# Altium schematic sheet QR_Scanning2_V1_STM32.SchDoc: QR_Scanning_V1_STM32
size 381 x 241 mm; ApprovedBy: VARUN; CheckedBy: VARUN; Author: non; CompanyName: Houston Systom Pvt. Ltd.; DrawnBy: VARUN; Engineer: VARUN; Address1: Greator Noida; SheetNumber: 3; SheetTotal: 3
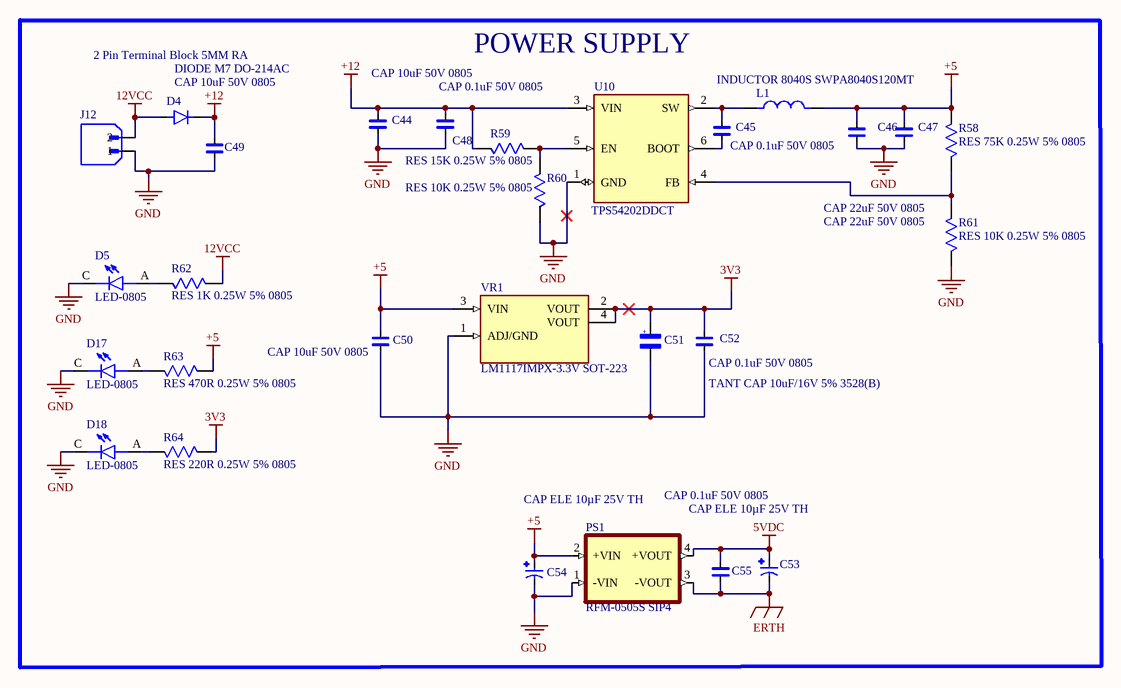
[diagram p0: QR_Scanning2_V1_STM32.SchDoc]

## Parts
C44  CAP 10uF 50V 0805  [CAP CER 0.1uF/50V 5%]
C45  CAP 0.1uF 50V 0805  [CAP CER 0.1uF/50V 5%]
C46  CAP 22uF 50V 0805  [CAP CER 0.1uF/50V 5%]
C47  CAP 22uF 50V 0805  [CAP CER 0.1uF/50V 5%]
C48  CAP 0.1uF 50V 0805  [CAP CER 0.1uF/50V 5%]
C49  CAP 10uF 50V 0805  [CAP CER 0.1uF/50V 5%]
C50  CAP 10uF 50V 0805  [CAP CER 0.1uF/50V 5%]
C51  TANT CAP 10uF/16V 5% 3528(B)  [TANT CAP 3528(B)]
C52  CAP 0.1uF 50V 0805  [CAP CER 0.1uF/50V 5%]
C53  CAP ELE 10µF 25V TH  [CAP ELE 10µF 25V TH]
C54  CAP ELE 10µF 25V TH  [CAP ELE 10µF 25V TH]
C55  CAP 0.1uF 50V 0805  [CAP CER 0.1uF/50V 5%]
D4  DIODE M7 DO-214AC  [DIODE M7 DO-214AC]
D5  LED-0805  [LED-0805]
D17  LED-0805  [LED-0805]
D18  LED-0805  [LED-0805]
J12  2 Pin Terminal Block 5MM RA  [2 Pin Terminal Block 5MM RA]
L1  INDUCTOR 8040S SWPA8040S120MT  [INDUCTOR 8040S SWPA8040S120MT]
PS1  RFM-0505S SIP4  [RFM-0505S]
R58  RES 75K 0.25W 5% 0805  [RES 0805 10K/0.25W 5%]
R59  RES 15K 0.25W 5% 0805  [RES 0805 10K/0.25W 5%]
R60  RES 10K 0.25W 5% 0805  [RES 0805 10K/0.25W 5%]
R61  RES 10K 0.25W 5% 0805  [RES 0805 10K/0.25W 5%]
R62  RES 1K 0.25W 5% 0805  [RES 0805 10K/0.25W 5%]
R63  RES 470R 0.25W 5% 0805  [RES 0805 10K/0.25W 5%]
R64  RES 220R 0.25W 5% 0805  [RES 0805 10K/0.25W 5%]
U10  TPS54202DDCT  [TPS54202DDCT]
VR1  LM1117IMPX-3.3V SOT-223  [LM1117IMPX-3.3V SOT-223]

## Blocks framed on the sheet
POWER SUPPLY: C44-C55 D4 D5 D17 D18 J12 L1 PS1 R58-R64 U10 VR1

## Nets
3V3: C51.1 C52.2 R64.2 VR1.2(VOUT) VR1.4(VOUT)
5VDC: C53.P C55.2 PS1.4(+VOUT)
12VCC: D4.A J12.2 R62.2
+5: C46.2 C47.2 C50.2 C54.P L1.2 PS1.2(+VIN) R58.2 R63.2 VR1.3(VIN)
+12: C44.2 C48.2 C49.2 D4.C(K) R59.1 U10.3(VIN)
ERTH: C53.N C55.1 PS1.3(-VOUT)
GND: C44.1 C46.1 C47.1 C48.1 C49.1 C50.1 C51.2 C52.1 C54.N D5.C D17.C D18.C J12.1 PS1.1(-VIN) R60.1 R61.1 U10.1(GND) VR1.1(ADJ/GND)
NetC45_1: C45.1 U10.6(BOOT)
NetC45_2: C45.2 L1.1 U10.2(SW)
NetD5_A: D5.A R62.1
NetD17_A: D17.A R63.1
NetD18_A: D18.A R64.1
NetR58_1: R58.1 R61.2 U10.4(FB)
NetR59_2: R59.2 R60.2 U10.5(EN)

## Notes on the sheet
- (in symbol TANT CAP 10uF/16V 5% 3528(B)) +

## Library data of the parts
C44-C50 C52 = CAP CER 0.1uF/50V 5%: CAP CER 0.1uF/50V  Ceramic Capacitor X7R 0805 (2012 Metric) SMT; MF: Samsung; MP: CL21B104KCFNNNE; Purchase-URL: https://pricing.snapeda.com/search?q=CL21B104KCFNNNE&ref=eda; Package: 0805 Samsung; Check_prices: https://www.snapeda.com/parts/CL21B104KCFNNNE/Samsung+Electro-Mechanics/view-part/?ref=eda; Value: *; SnapEDA_Link: https://www.snapeda.com/parts/CL21B104KCFNNNE/Samsung+Electro-Mechanics/view-part/?ref=snap; Digi-Key_Part_Number: 1276-6840-2-ND
C51 = TANT CAP 10uF/16V 5% 3528(B): 10 ÂµF Molded Tantalum Polymer Capacitor 25 V 1411 (3528 Metric), 1210 150mOhm TCJB106M025R0150; MF: AVX; SnapEDA_Link: https://www.snapeda.com/parts/TCJB106M025R0150/AVX/view-part/?ref=snap; Package: 1210 AVX; Value: *; MP: TCJB106M025R0150; Check_prices: https://www.snapeda.com/parts/TCJB106M025R0150/AVX/view-part/?ref=eda
C53 C54 = CAP ELE 10µF 25V TH: 10µF 25V Aluminum Electrolytic Capacitors Radial Lead Type TH, Dia-5mm, Pitch-2mm ECEA1EN100UI; MF: Panasonic; Package: RADIAL-2 Panasonic; Purchase-URL: https://pricing.snapeda.com/search/part/ECEA1EN100UI/?ref=eda; Value: *; Digi-Key_Part_Number: ECE-A1EN100UI-ND; SnapEDA_Link: https://www.snapeda.com/parts/ECEA1EN100UI/Panasonic/view-part/5788532/?ref=snap; MP: ECEA1EN100UI; Check_prices: https://www.snapeda.com/parts/ECEA1EN100UI/Panasonic/view-part/5788532/?ref=eda
C55 = CAP CER 0.1uF/50V 5%: CAP CER 0.1uF/50V  Ceramic Capacitor X7R 0805 (2012 Metric); MF: Samsung; MP: CL21B104KCFNNNE; Purchase-URL: https://pricing.snapeda.com/search?q=CL21B104KCFNNNE&ref=eda; Package: 0805 Samsung; Check_prices: https://www.snapeda.com/parts/CL21B104KCFNNNE/Samsung+Electro-Mechanics/view-part/?ref=eda; Value: *; SnapEDA_Link: https://www.snapeda.com/parts/CL21B104KCFNNNE/Samsung+Electro-Mechanics/view-part/?ref=snap; Digi-Key_Part_Number: 1276-6840-2-ND
D4 = DIODE M7 DO-214AC: M7 General Purpose SMD Rectifier Diode SMA (DO-214AC) 1A 1000V 1n4007 RS2MA; MF: Taiwan Semiconductor; SnapEDA_Link: https://www.snapeda.com/parts/RS2MA/Taiwan+Semiconductor/view-part/?ref=snap; Package: DO-214AC-2 Taiwan Semiconductor; Value: *; MP: RS2MA; Check_prices: https://www.snapeda.com/parts/RS2MA/Taiwan+Semiconductor/view-part/?ref=eda
D5 D17 D18 = LED-0805: Red 640nm LED Indication - Discrete 1.85V 0805 (2012 Metric) APT2012SRCPRV; MF: Kingbright; SnapEDA_Link: https://www.snapeda.com/parts/APT2012SRCPRV/Kingbright/view-part/?ref=snap; Package: 0805 Kingbright; Value: *; MP: APT2012SRCPRV; Check_prices: https://www.snapeda.com/parts/APT2012SRCPRV/Kingbright/view-part/?ref=eda
J12 = 2 Pin Terminal Block 5MM RA: 2 Pin Terminal Block HDR 5MM THT RA _OQ0271510000G; MF: Amphenol Anytek; SnapEDA_Link: https://www.snapeda.com/parts/OQ0271510000G/Amphenol/view-part/?ref=snap; Package: None; Value: *; MP: OQ0271510000G; Check_prices: https://www.snapeda.com/parts/OQ0271510000G/Amphenol/view-part/?ref=eda
L1 = INDUCTOR 8040S SWPA8040S120MT: SWPA8040S120MT SMD 8.0×8.0x4.0mm 8040S 12uH Â±20% 2.8A 142 mOhm SMT Shielded Wirewound Inductor; MF: Abracon LLC; MP: ASPI-8040S-510M-T; Purchase-URL: https://pricing.snapeda.com/search/part/ASPI-8040S-510M-T/?ref=eda; Value: *; SnapEDA_Link: https://www.snapeda.com/parts/ASPI-8040S-510M-T/Abracon+LLC/view-part/?ref=snap; Package: Nonstandard Abracon LLC; Check_prices: https://www.snapeda.com/parts/ASPI-8040S-510M-T/Abracon+LLC/view-part/?ref=eda; Availability: In Stock; Price: None
PS1 = RFM-0505S: DC-DC Converter/Isolator, SIP4, 1kV unreg, Single Output, 1W, 5V Out, RFM Series | RECOM Power Inc. RFM-0505S; SnapEDA_Link: https://www.snapeda.com/parts/RFM-0505S/Recom+Power/view-part/?ref=snap; Package: SIP-4 Recom Power; Value: *; MF: Recom Power; MP: RFM-0505S; Check_prices: https://www.snapeda.com/parts/RFM-0505S/Recom+Power/view-part/?ref=eda
R58-R64 = RES 10K 0.25W 5% 0805: RESISTOR, THICK FILM, 10K, 5%, 0805 0.25W SMT; MP: ERJ-6GEYJ103V; MF: Panasonic Electronic; Price: None; Check_prices: https://www.snapeda.com/parts/ERJ-6GEYJ103V/Panasonic+Electronic+Components/view-part/?ref=eda; Package: 805-2 Panasonic; Purchase-URL: https://pricing.snapeda.com/search/part/ERJ-6GEYJ103V/?ref=eda; Availability: In Stock; SnapEDA_Link: https://www.snapeda.com/parts/ERJ-6GEYJ103V/Panasonic+Electronic+Components/view-part/?ref=snap; Value: *
U10 = TPS54202DDCT: 4.5V to 28V Input, 2A Output, EMI Friendly Synchronous Step-Down Converter SOT23-6; MF: Texas Instruments; SnapEDA_Link: https://www.snapeda.com/parts/TPS54202DDCT/Texas+Instruments/view-part/?ref=snap; Package: SOT-23-THN-6 Texas Instruments; Value: *; MP: TPS54202DDCT; Check_prices: https://www.snapeda.com/parts/TPS54202DDCT/Texas+Instruments/view-part/?ref=eda
VR1 = LM1117IMPX-3.3V SOT-223: LM1117IMPX-3.3V 800-mA 15-V linear voltage regulator SOT-223; MF: Texas Instruments; MP: LM1117IMPX-5.0/NOPB; SnapEDA_Link: https://www.snapeda.com/parts/LM1117IMPX-5.0/NOPB/Texas+Instruments/view-part/?ref=snap; Package: SOT-223-4 Texas Instruments; Value: *; Check_prices: https://www.snapeda.com/parts/LM1117IMPX-5.0/NOPB/Texas+Instruments/view-part/?ref=eda